# EAGLE design SuperLogger_widewithESPSIM800bevorrouting (EAGLE 8.0.1)
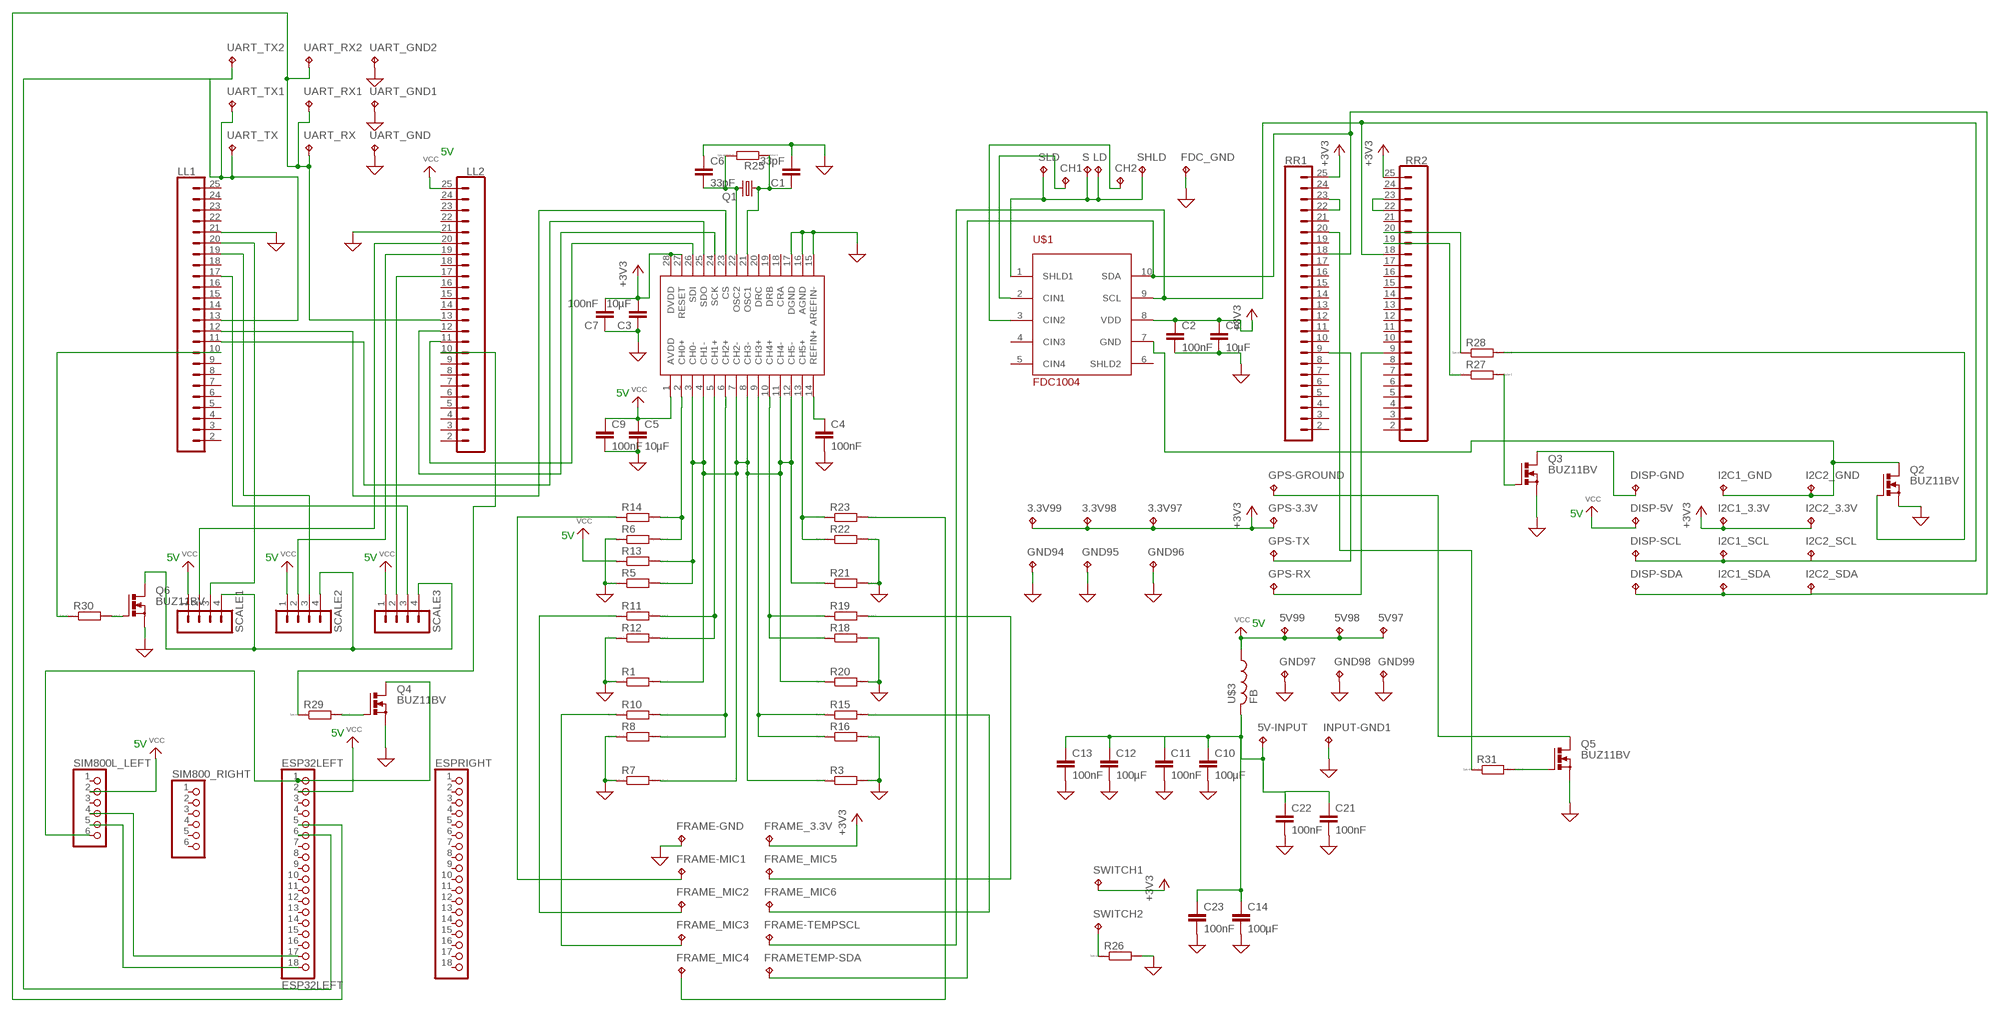
[diagram p0: schematic, sheet 1]

## Parts
3.3V97  ground  TPPAD1-13Y  [P1-13Y]
3.3V98  ground  TPPAD1-13Y  [P1-13Y]
3.3V99  ground  TPPAD1-13Y  [P1-13Y]
5V97  ground  TPPAD1-13Y  [P1-13Y]
5V98  ground  TPPAD1-13Y  [P1-13Y]
5V99  ground  TPPAD1-13Y  [P1-13Y]
5V-INPUT  ground  TPPAD1-13Y  [P1-13Y]
C1  33pF  C5/3  [C5B3]
C2  100nF  C5/3  [C5B3]
C3  10µF  C5/3  [C5B3]
C4  100nF  C5/3  [C5B3]
C5  10µF  C5/3  [C5B3]
C6  33pF  C5/3  [C5B3]
C7  100nF  C5/3  [C5B3]
C8  10µF  C5/3  [C5B3]
C9  100nF  C5/3  [C5B3]
C10  100µF  C5/3  [C5B3]
C11  100nF  C5/3  [C5B3]
C12  100µF  C5/3  [C5B3]
C13  100nF  C5/3  [C5B3]
C14  100µF  C5/3  [C5B3]
C21  100nF  C5/3  [C5B3]
C22  100nF  C5/3  [C5B3]
C23  100nF  C5/3  [C5B3]
CH1  ground  TPPAD1-13Y  [P1-13Y]
CH2  ground  TPPAD1-13Y  [P1-13Y]
DISP-5V  ground  TPPAD1-13Y  [P1-13Y]
DISP-GND  ground  TPPAD1-13Y  [P1-13Y]
DISP-SCL  ground  TPPAD1-13Y  [P1-13Y]
DISP-SDA  ground  TPPAD1-13Y  [P1-13Y]
ESP32LEFT  ESP32LEFT  PINHD-1X18-BIG  [1X18-BIG]
ESPRIGHT  PINHD-1X18-BIG  [1X18-BIG]
FDC_GND  ground  TPPAD1-13Y  [P1-13Y]
FRAME-GND  ground  TPPAD1-13Y  [P1-13Y]
FRAME-MIC1  ground  TPPAD1-13Y  [P1-13Y]
FRAME-TEMPSCL  ground  TPPAD1-13Y  [P1-13Y]
FRAME_3.3V  ground  TPPAD1-13Y  [P1-13Y]
FRAME_MIC2  ground  TPPAD1-13Y  [P1-13Y]
FRAME_MIC3  ground  TPPAD1-13Y  [P1-13Y]
FRAME_MIC4  ground  TPPAD1-13Y  [P1-13Y]
FRAME_MIC5  ground  TPPAD1-13Y  [P1-13Y]
FRAME_MIC6  ground  TPPAD1-13Y  [P1-13Y]
FRAMETEMP-SDA  ground  TPPAD1-13Y  [P1-13Y]
GND94  ground  TPPAD1-13Y  [P1-13Y]
GND95  ground  TPPAD1-13Y  [P1-13Y]
GND96  ground  TPPAD1-13Y  [P1-13Y]
GND97  ground  TPPAD1-13Y  [P1-13Y]
GND98  ground  TPPAD1-13Y  [P1-13Y]
GND99  ground  TPPAD1-13Y  [P1-13Y]
GPS-3.3V  ground  TPPAD1-13Y  [P1-13Y]
GPS-GROUND  ground  TPPAD1-13Y  [P1-13Y]
GPS-RX  ground  TPPAD1-13Y  [P1-13Y]
GPS-TX  ground  TPPAD1-13Y  [P1-13Y]
I2C1_3.3V  ground  TPPAD1-13Y  [P1-13Y]
I2C1_GND  ground  TPPAD1-13Y  [P1-13Y]
I2C1_SCL  ground  TPPAD1-13Y  [P1-13Y]
I2C1_SDA  ground  TPPAD1-13Y  [P1-13Y]
I2C2_3.3V  ground  TPPAD1-13Y  [P1-13Y]
I2C2_GND  ground  TPPAD1-13Y  [P1-13Y]
I2C2_SCL  ground  TPPAD1-13Y  [P1-13Y]
I2C2_SDA  ground  TPPAD1-13Y  [P1-13Y]
INPUT-GND1  ground  TPPAD1-13Y  [P1-13Y]
LD  ground  TPPAD1-13Y  [P1-13Y]
LL1  CONN_24  [1X24]
LL2  CONN_24  [1X24]
Q1  CRYSTALHC49S  [HC49/S]
Q2  BUZ11BV  [TO220BV]
Q3  BUZ11BV  [TO220BV]
Q4  BUZ11BV  [TO220BV]
Q5  BUZ11BV  [TO220BV]
Q6  BUZ11BV  [TO220BV]
R1  R0207/10  [0207/10]
R3  R0207/10  [0207/10]
R5  R0207/10  [0207/10]
R6  R0207/10  [0207/10]
R7  R0207/10  [0207/10]
R8  R0207/10  [0207/10]
R10  R0207/10  [0207/10]
R11  R0207/10  [0207/10]
R12  R0207/10  [0207/10]
R13  R0207/10  [0207/10]
R14  R0207/10  [0207/10]
R15  R0207/10  [0207/10]
R16  R0207/10  [0207/10]
R18  R0207/10  [0207/10]
R19  R0207/10  [0207/10]
R20  R0207/10  [0207/10]
R21  R0207/10  [0207/10]
R22  R0207/10  [0207/10]
R23  R0207/10  [0207/10]
R25  R0207/10  [0207/10]
R26  R0207/10  [0207/10]
R27  R0207/10  [0207/10]
R28  R0207/10  [0207/10]
R29  R0207/10  [0207/10]
R30  R0207/10  [0207/10]
R31  R0207/10  [0207/10]
RR1  CONN_24  [1X24]
RR2  CONN_24  [1X24]
S  ground  TPPAD1-13Y  [P1-13Y]
SCALE1  MA04-1  [MA04-1]
SCALE2  MA04-1  [MA04-1]
SCALE3  MA04-1  [MA04-1]
SHLD  ground  TPPAD1-13Y  [P1-13Y]
SIM800_RIGHT  PINHD-1X6  [1X06]
SIM800L_LEFT  PINHD-1X6  [1X06]
SLD  ground  TPPAD1-13Y  [P1-13Y]
SWITCH1  ground  TPPAD1-13Y  [P1-13Y]
SWITCH2  ground  TPPAD1-13Y  [P1-13Y]
U$1  FDC1004  [MSOP10]
U$2  MCP3903  [MSOP8_0.65MM]
U$3  FB  [FB]
UART_GND  ground  TPPAD1-13Y  [P1-13Y]
UART_GND1  ground  TPPAD1-13Y  [P1-13Y]
UART_GND2  ground  TPPAD1-13Y  [P1-13Y]
UART_RX  ground  TPPAD1-13Y  [P1-13Y]
UART_RX1  ground  TPPAD1-13Y  [P1-13Y]
UART_RX2  ground  TPPAD1-13Y  [P1-13Y]
UART_TX  ground  TPPAD1-13Y  [P1-13Y]
UART_TX1  ground  TPPAD1-13Y  [P1-13Y]
UART_TX2  ground  TPPAD1-13Y  [P1-13Y]

## Nets
+3V3: 3.3V97.TP 3.3V98.TP 3.3V99.TP C2.1 C3.2 C7.2 C8.1 FRAME_3.3V.TP GPS-3.3V.TP I2C1_3.3V.TP I2C2_3.3V.TP RR1.25 RR2.25 SWITCH1.TP U$1.8(VDD) U$2.27(RESET) U$2.28(DVDD)
GND: C1.2 C2.2 C3.1 C4.2 C5.2 C6.1 C7.1 C8.2 C9.2 C10.2 C11.2 C12.2 C13.2 C14.2 C21.2 C22.2 C23.2 FDC_GND.TP FRAME-GND.TP GND94.TP GND95.TP GND96.TP GND97.TP GND98.TP GND99.TP INPUT-GND1.TP LL1.21 LL2.21 Q2.S Q3.S Q4.S Q5.S Q6.S R1.1 R3.2 R5.1 R6.1 R7.1 R8.1 R12.1 R16.2 R18.2 R20.2 R21.2 R22.2 R26.2 U$2.15(AREFIN-) U$2.16(AGND) U$2.17(DGND) UART_GND1.TP UART_GND2.TP UART_GND.TP ; supply symbol labelled SUP
N$1: ESP32LEFT.6 LL1.13 UART_TX1.TP UART_TX2.TP UART_TX.TP
N$2: R15.1 R16.1 U$2.9(CH3+)
N$3: DISP-SDA.TP FRAMETEMP-SDA.TP I2C1_SDA.TP I2C2_SDA.TP RR1.18 U$1.10(SDA)
N$4: R26.1 SWITCH2.TP
N$5: FRAME_MIC3.TP R10.1
N$6: LL2.17 SCALE3.2
N$7: LD.TP S.TP SHLD.TP SLD.TP U$1.1(SHLD1)
N$8: DISP-SCL.TP FRAME-TEMPSCL.TP I2C1_SCL.TP I2C2_SCL.TP RR2.18 U$1.9(SCL)
N$9: CH1.TP U$1.2(CIN1)
N$10: ESP32LEFT.5 LL2.13 UART_RX1.TP UART_RX2.TP UART_RX.TP
N$11: I2C1_GND.TP I2C2_GND.TP Q2.D U$1.7(GND)
N$12: LL2.19 SCALE2.2
N$13: Q2.G R28.2
N$14: LL2.20 SCALE1.2
N$15: LL1.19 SCALE2.3
N$16: LL1.20 SCALE1.3
N$18: R22.1 R23.1 U$2.13(CH5+)
N$19: C6.2 Q1.2 R25.2 U$2.22(OSC2)
N$20: C1.1 Q1.1 R25.1 U$2.21(OSC1)
N$22: LL1.12 U$2.23(CS)
N$23: LL2.12 U$2.24(SCK)
N$25: FRAME-MIC1.TP R14.1
N$26: FRAME_MIC2.TP R11.1
N$27: ESP32LEFT.18 SIM800L_LEFT.5
N$28: R8.2 R10.2 U$2.6(CH2+)
N$29: R11.2 R12.2 U$2.5(CH1+)
N$30: FRAME_MIC6.TP R15.2
N$33: RR2.22 RR2.23
N$34: R1.2 R3.1 R5.2 R7.2 R13.2 R20.1 R21.1 U$2.3(CH0-) U$2.4(CH1-) U$2.7(CH2-) U$2.8(CH3-) U$2.11(CH4-) U$2.12(CH5-)
N$35: R6.2 R14.2 U$2.2(CH0+)
N$36: R18.1 R19.1 U$2.10(CH4+)
N$37: LL1.11 U$2.25(SDO)
N$38: ESP32LEFT.17 SIM800L_LEFT.4
N$39: Q4.G R29.2
N$40: FRAME_MIC4.TP R23.2
N$41: LL2.11 U$2.26(SDI)
N$42: GPS-RX.TP RR2.9
N$43: Q6.D SCALE1.4 SCALE2.4 SCALE3.4
N$44: CH2.TP U$1.3(CIN2)
N$45: GPS-TX.TP RR1.9
N$46: RR1.22 RR1.23
N$47: Q3.G R27.2
N$48: ESP32LEFT.1 Q4.D SIM800L_LEFT.6
N$49: DISP-GND.TP Q3.D
N$50: R31.1 RR1.20
N$51: GPS-GROUND.TP Q5.D
N$52: FRAME_MIC5.TP R19.2
N$53: Q6.G R30.2
N$54: Q5.G R31.2
N$55: R28.1 RR2.20
N$56: C4.1 U$2.14(REFIN+)
N$57: R27.1 RR2.19
N$58: LL1.17 SCALE3.3
N$59: LL1.10 R30.1
N$60: LL2.10 R29.1
VCC: 5V97.TP 5V98.TP 5V99.TP 5V-INPUT.TP C5.1 C9.1 C10.1 C11.1 C12.1 C13.1 C14.1 C21.1 C22.1 C23.1 DISP-5V.TP ESP32LEFT.2 LL2.25 R13.1 SCALE1.1 SCALE2.1 SCALE3.1 SIM800L_LEFT.2 U$2.1(AVDD) U$3.P$1 U$3.P$2
Unconnected: ESP32LEFT.3 ESP32LEFT.4 ESP32LEFT.7 ESP32LEFT.8 ESP32LEFT.9 ESP32LEFT.10 ESP32LEFT.11 ESP32LEFT.12 ESP32LEFT.13 ESP32LEFT.14 ESP32LEFT.15 ESP32LEFT.16 ESPRIGHT.1 ESPRIGHT.2 ESPRIGHT.3 ESPRIGHT.4 ESPRIGHT.5 ESPRIGHT.6 ESPRIGHT.7 ESPRIGHT.8 ESPRIGHT.9 ESPRIGHT.10 ESPRIGHT.11 ESPRIGHT.12 ESPRIGHT.13 ESPRIGHT.14 ESPRIGHT.15 ESPRIGHT.16 ESPRIGHT.17 ESPRIGHT.18 LL1.2 LL1.3 LL1.4 LL1.5 LL1.6 LL1.7 LL1.8 LL1.9 LL1.14 LL1.15 LL1.16 LL1.18 LL1.22 LL1.23 LL1.24 LL1.25 LL2.2 LL2.3 LL2.4 LL2.5 LL2.6 LL2.7 LL2.8 LL2.9 LL2.14 LL2.15 LL2.16 LL2.18 LL2.22 LL2.23 LL2.24 RR1.2 RR1.3 RR1.4 RR1.5 RR1.6 RR1.7 RR1.8 RR1.10 RR1.11 RR1.12 RR1.13 RR1.14 RR1.15 RR1.16 RR1.17 RR1.19 RR1.21 RR1.24 RR2.2 RR2.3 RR2.4 RR2.5 RR2.6 RR2.7 RR2.8 RR2.10 RR2.11 RR2.12 RR2.13 RR2.14 RR2.15 RR2.16 RR2.17 RR2.21 RR2.24 SIM800_RIGHT.1 SIM800_RIGHT.2 SIM800_RIGHT.3 SIM800_RIGHT.4 SIM800_RIGHT.5 SIM800_RIGHT.6 SIM800L_LEFT.1 SIM800L_LEFT.3 U$1.4(CIN3) U$1.5(CIN4) U$1.6(SHLD2) U$2.18(CRA) U$2.19(DRB) U$2.20(DRC)

## Notes on the sheet
- 5V
- 5V
- 5V
- 5V
- 5V | 5V | 5V
- 5V
- 5V
- 5V

## Library data of the parts
3.3V97-3.3V99 5V97-5V99 5V-INPUT CH1 CH2 DISP-5V DISP-GND DISP-SCL DISP-SDA FDC_GND FRAME-GND FRAME-MIC1 FRAME-TEMPSCL FRAME_3.3V FRAME_MIC2-FRAME_MIC6 FRAMETEMP-SDA GND94-GND99 GPS-3.3V GPS-GROUND GPS-RX GPS-TX I2C1_3.3V I2C1_GND I2C1_SCL I2C1_SDA I2C2_3.3V I2C2_GND I2C2_SCL I2C2_SDA INPUT-GND1 LD S SHLD SLD SWITCH1 SWITCH2 UART_GND UART_GND1 UART_GND2 UART_RX UART_RX1 UART_RX2 UART_TX UART_TX1 UART_TX2 = testpad:TP: Test pad
C1-C14 C21-C23 = capacitor-wima:C: CAPACITOR naming: grid - package width
ESP32LEFT ESPRIGHT = adafruit:PINHD-1X18: PIN HEADER
LL1 LL2 RR1 RR2 = SparkFun-Connectors:CONN_24: Multi connection point. Often used as Generic Header-pin footprint for 0.1 inch spaced/style header connections On any of the 0.1 inch spaced packages, you can populate with these: Break Away Headers - Straight <https://www.sparkfun.com/products/116> (PRT-00116) Break Away Male Headers - Right Angle <https://www.sparkfun.com/products/553> (PRT-00553) Female Headers <https://www.sparkfun.com/products/115> (PRT-00115) Break Away Headers - Machine Pin <https://www.sparkfun.com/products/117> (PRT-00117) Break Away Female Headers - Swiss Machine Pin <https://www.sparkfun.com/products/743> (PRT-00743) For SCREWTERMINALS and SPRING TERMINALS visit here: Screw Terimnals on SparkFun.com <https://www.sparkfun.com/search/results?term=Screw+Terminals> (5mm/3.5mm/2.54mm spacing) This device is also useful as a general connection point to wire up your design to another part of your project. Our various solder wires solder well into these plated through hole pads. Hook-Up Wire - Assortment (Stranded, 22 AWG) <https://www.sparkfun.com/products/11375> (PRT-11375) Hook-Up Wire - Assortment (Solid Core, 22 AWG) <https://www.sparkfun.com/products/11367> (PRT-11367) View the entire wire category on our website here <https://www.sparkfun.com/categories/141> Special notes: Molex polarized connector foot print use with SKU : PRT-08231 with associated crimp pins and housings. 1MM SMD Version SKU: PRT-10208 NOTES ON THE VARIANTS LOCK and LOCK_LONGPADS... This footprint was designed to help hold the alignment of a through-hole component (i.e. 6-pin header) while soldering it into place. You may notice that each hole has been shifted either up or down by 0.005 of an inch from it's more standard position (which is a perfectly straight line). This slight alteration caused the pins (the squares in the middle) to touch the edges of the holes. Because they are alternating, it causes a "brace" to hold the component in place. 0.005 has proven to be the perfect amount of "off-center" position when using our standard breakaway headers. Although looks a little odd when you look at the bare footprint, once you have a header in there, the alteration is very hard to notice. Also,if you push a header all the way into place, it is covered up entirely on the bottom side.
Q1 = adafruit:CRYSTAL: CRYSTAL; OC_FARNELL: 1667008; OC_NEWARK: unknown
Q2-Q6 = transistor-power:BUZ11: N-CHANNEL MOS FET
R1 R3 R5-R8 R10-R16 R18-R23 R25-R31 = eagle-ltspice:R: RESISTOR, European symbol; SPICEMODEL: NONE; SPICEPREFIX: R
SCALE1-SCALE3 = con-lstb:MA04-1: PIN HEADER; OC_FARNELL: unknown; OC_NEWARK: unknown
SIM800_RIGHT SIM800L_LEFT = adafruit:PINHD-1X6: PIN HEADER
U$1 = eigene:FDC1004
U$2 = eigene:MCP3903
U$3 = adafruit:FB: Ferrite bead Digikey #P9821BK-ND

## Board
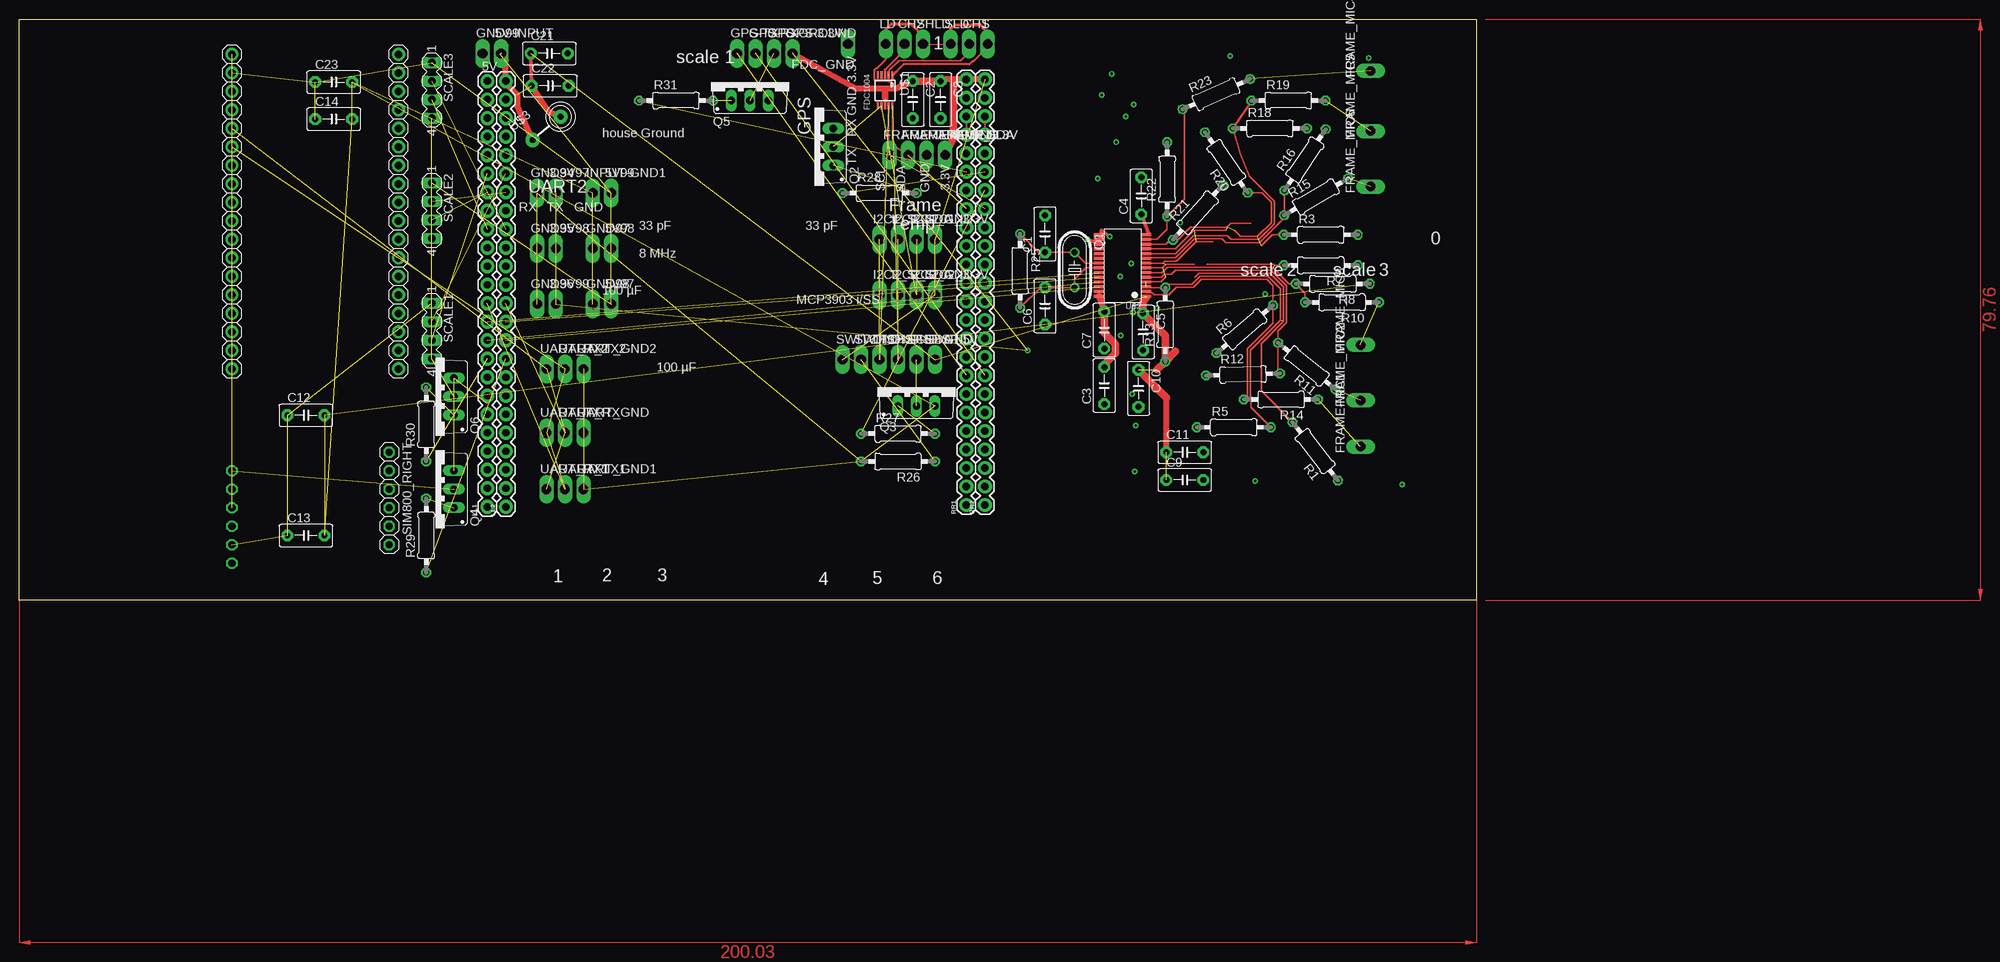
[diagram p1: board, top side]
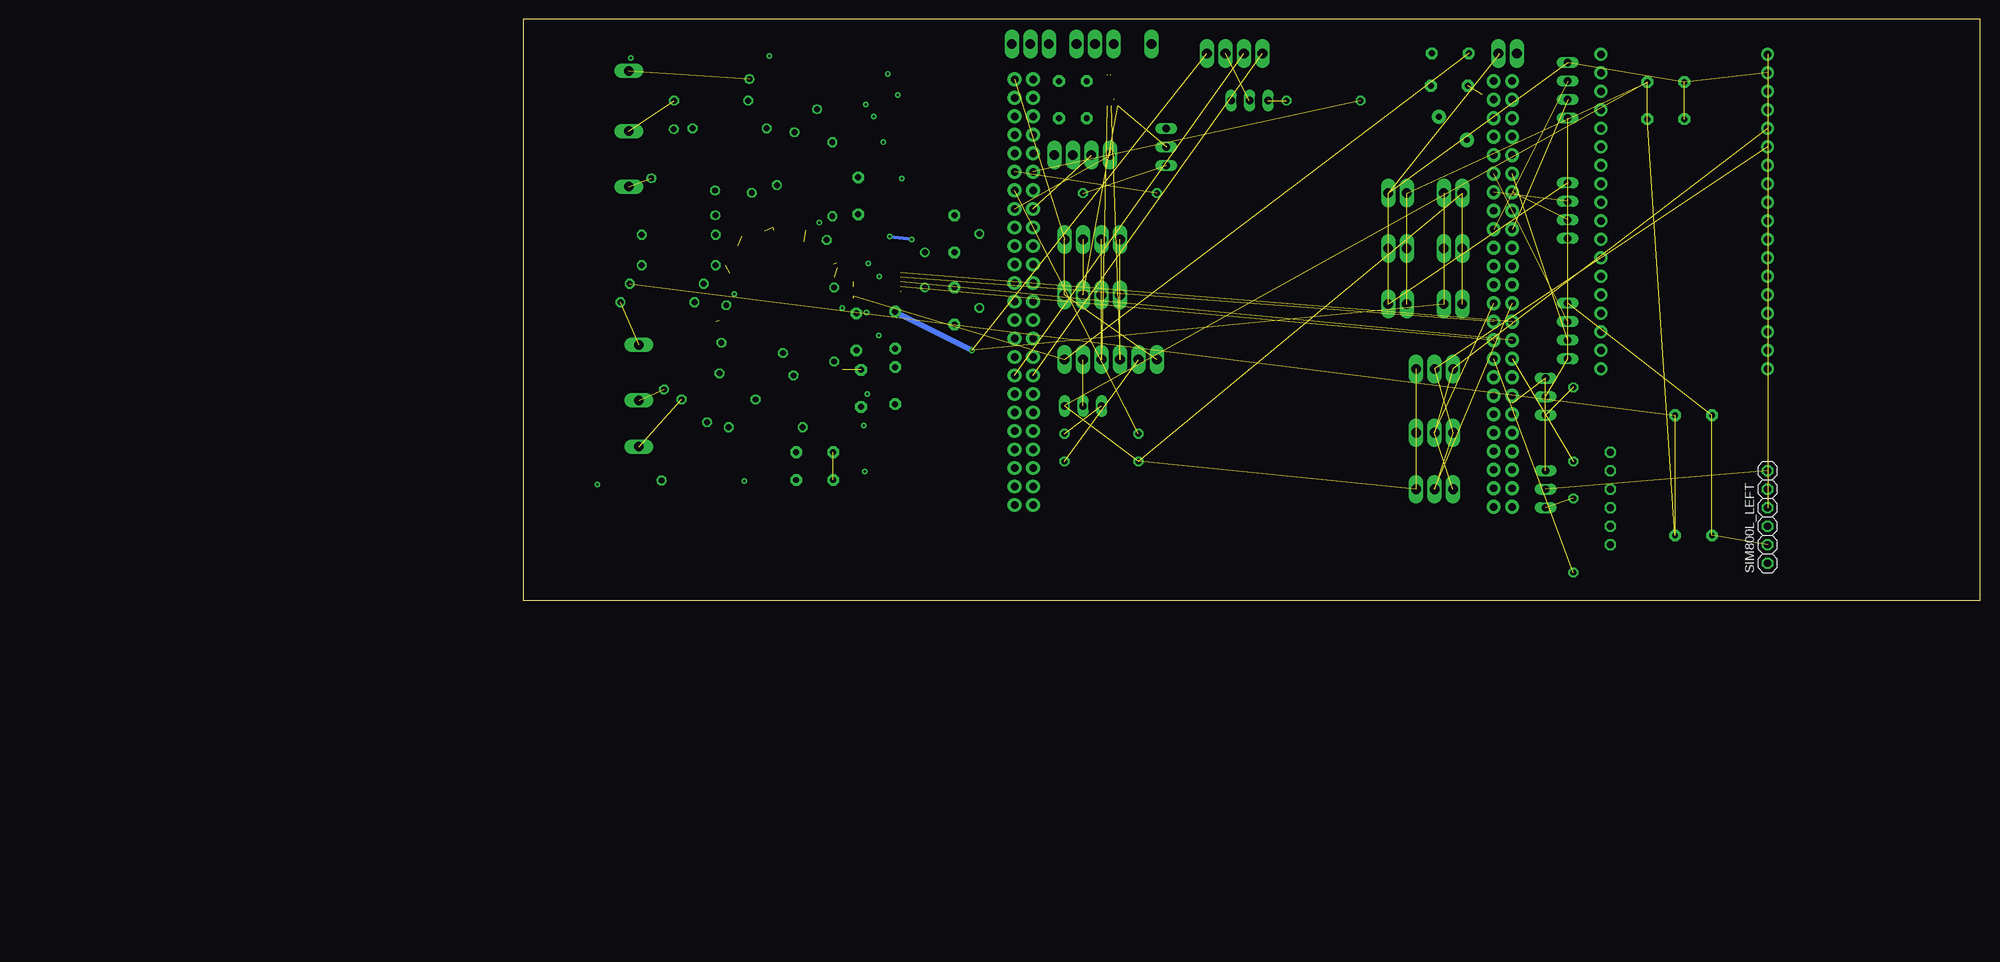
[diagram p2: board, bottom side, seen from below]

Size 200.03 x 79.76 mm. Coordinates in mm from the lower left corner, seen from the top.
Outline: 0,0 0,79.76 200.03,79.76 200.03,0 0,0
Copper layers (1*16): Top 0.035mm / dielectric 1.5mm / Bottom 0.035mm
Design rules "default *": minimum track width 6mil, minimum drill 0.35mm, track to track 8mil, track to pad 8mil, pad to pad 8mil, via to via 8mil, smd to smd 8mil, copper to edge 40mil, drill to drill 6mil, minimum pad ring 10mil, minimum via ring 8mil, stop-mask expansion 4mil, vias tented up to drill 0mil, thermal gap 10mil

### Footprints (pad centres in the part's own frame; a part is rotated, then mirrored left to right if it is on the bottom)
P1-13Y = drill 1.321 pad 1.905 long: TP 0,0
C5B3 = drill 0.813 pad 1.6 octagon: 1 -2.54,0; 2 2.54,0
1X18-BIG = drill 1.016 pad 1.778: 1 -21.59,0; 2 -19.05,0; 3 -16.51,0; 4 -13.97,0; 5 -11.43,0; 6 -8.89,0; 7 -6.35,0; 8 -3.81,0; 9 -1.27,0; 10 1.27,0; 11 3.81,0; 12 6.35,0; 13 8.89,0; 14 11.43,0; 15 13.97,0; 16 16.51,0; 17 19.05,0; 18 21.59,0
1X24 = drill 1.016 pad 1.88: 2 -26.67,0; 3 -24.13,0; 4 -21.59,0; 5 -19.05,0; 6 -16.51,0; 7 -13.97,0; 8 -11.43,0; 9 -8.89,0; 10 -6.35,0; 11 -3.81,0; 12 -1.27,0; 13 1.27,0; 14 3.81,0; 15 6.35,0; 16 8.89,0; 17 11.43,0; 18 13.97,0; 19 16.51,0; 20 19.05,0; 21 21.59,0; 22 24.13,0; 23 26.67,0; 24 29.21,0; 25 31.75,0
HC49/S = drill 0.813: 1 -2.413,0; 2 2.413,0
TO220BV = drill 1.016 long: D 0,-2.54; G -2.54,-2.54; S 2.54,-2.54
0207/10 = drill 0.813 octagon: 1 -5.08,0; 2 5.08,0
MA04-1 = drill 1.016 long: 1 -3.81,0; 2 -1.27,0; 3 1.27,0; 4 3.81,0
1X06 = drill 1.016 octagon: 1 -6.35,0; 2 -3.81,0; 3 -1.27,0; 4 1.27,0; 5 3.81,0; 6 6.35,0
MSOP10 = smd 0.25 x 1: 1 -1,-2.113; 2 -0.5,-2.113; 3 0,-2.113; 4 0.5,-2.113; 5 1,-2.113; 6 1,2.113; 7 0.5,2.113; 8 0,2.113; 9 -0.5,2.113; 10 -1,2.113
MSOP8_0.65MM = smd 0.4 x 1.4: 1 -0.175,-2.3; 2 0.475,-2.3; 3 1.125,-2.3; 4 1.775,-2.3; 5 2.425,-2.3; 6 3.075,-2.3; 7 3.725,-2.3; 8 4.375,-2.3; 9 5.025,-2.3; 10 5.675,-2.3; 11 6.325,-2.3; 12 6.975,-2.3; 13 7.625,-2.3; 14 8.275,-2.3; 15 8.275,4.15; 16 7.625,4.15; 17 6.975,4.15; 18 6.325,4.15; 19 5.675,4.15; 20 5.025,4.15; 21 4.375,4.15; 22 3.725,4.15; 23 3.075,4.15; 24 2.425,4.15; 25 1.775,4.15; 26 1.125,4.15; 27 0.475,4.15; 28 -0.175,4.15
FB = drill 0.8 pad 1.93: P$1 -2.5,0; P$2 2.5,0

### Placement (x,y rotation side)
3.3V97  73.66,55.88 0 top
3.3V98  73.66,48.26 0 top
3.3V99  73.66,40.64 0 top
5V97  81.28,40.64 0 top
5V98  81.28,48.26 0 top
5V99  81.28,55.88 0 top
5V-INPUT  66.17,75.06 0 top
C1  140.84,50.29 90 top
C2  122.68,68.71 270 top
C3  148.97,29.46 90 top
C4  154.05,55.5 90 top
C5  154.31,36.83 270 top
C6  140.84,40.39 90 top
C7  148.97,37.08 90 top
C8  126.49,68.71 270 top
C9  160.02,16.51 0 top
C10  153.67,29.08 270 top
C11  160.02,20.32 0 top
C12  39.37,25.4 0 top
C13  39.37,8.89 0 top
C14  43.18,66.04 0 top
C21  72.77,75.06 0 top
C22  72.9,70.61 0 top
C23  43.18,71.12 0 top
CH1  130.43,76.33 0 top
CH2  121.54,76.33 0 top
DISP-5V  125.73,33.02 0 top
DISP-GND  123.19,33.02 0 top
DISP-SCL  118.11,33.02 0 top
DISP-SDA  120.65,33.02 0 top
ESP32LEFT  29.21,53.34 270 top
ESPRIGHT  52.07,53.34 270 top
FDC_GND  113.79,76.33 180 top
FRAME-GND  124.59,61.09 0 top
FRAME-MIC1  184.15,21.08 90 top
FRAME-TEMPSCL  119.51,61.09 0 top
FRAME_3.3V  127.13,61.09 0 top
FRAME_MIC2  184.15,27.43 90 top
FRAME_MIC3  184.15,35.05 90 top
FRAME_MIC4  185.55,72.64 90 top
FRAME_MIC5  185.55,64.39 90 top
FRAME_MIC6  185.55,56.77 90 top
FRAMETEMP-SDA  122.05,61.09 0 top
GND94  71.12,55.88 0 top
GND95  71.12,48.26 0 top
GND96  71.12,40.64 0 top
GND97  78.74,48.26 0 top
GND98  78.74,40.64 0 top
GND99  63.63,75.06 0 top
GPS-3.3V  106.17,75.06 0 top
GPS-GROUND  103.63,75.06 0 top
GPS-RX  101.09,75.06 0 top
GPS-TX  98.55,75.06 0 top
I2C1_3.3V  125.73,49.53 0 top
I2C1_GND  123.19,49.53 0 top
I2C1_SCL  118.11,49.53 0 top
I2C1_SDA  120.65,49.53 0 top
I2C2_3.3V  125.73,41.91 0 top
I2C2_GND  123.19,41.91 0 top
I2C2_SCL  118.11,41.91 0 top
I2C2_SDA  120.65,41.91 0 top
INPUT-GND1  78.74,55.88 0 top
LD  119,76.33 0 top
LL1  64.26,39.5 90 top
LL2  66.8,39.5 90 top
Q1  144.91,45.34 270 top
Q2  109.22,62.23 90 top
Q3  123.19,29.21 0 top
Q4  57.15,15.24 90 top
Q5  100.33,71.12 0 top
Q6  57.15,27.94 90 top
R1  177.93,20.45 127.9 top
R3  178.69,50.16 0 top
R5  166.75,23.75 0 top
R6  168.28,37.21 40.2 top
R7  178.69,45.97 180 top
R8  180.34,43.43 180 top
R10  181.61,40.89 180 top
R11  176.78,32.13 140.9 top
R12  168.02,30.99 1.6 top
R13  157.35,37.85 90 top
R14  173.23,27.56 180 top
R15  178.05,55.37 30 top
R16  176.53,60.45 56 top
R18  171.7,64.77 0 top
R19  174.24,68.58 0 top
R20  165.74,60.07 125.2 top
R21  161.8,53.21 47.7 top
R22  157.61,57.78 90 top
R23  164.34,69.47 24.1 top
R25  137.41,45.21 270 top
R26  120.65,19.05 180 top
R27  120.65,22.86 0 top
R28  118.11,55.88 0 top
R29  55.88,8.89 90 top
R30  55.88,24.13 90 top
R31  90.17,68.58 0 top
RR1  130.05,39.75 90 top
RR2  132.59,39.75 90 top
S  132.97,76.33 0 top
SCALE1  56.64,36.96 270 top
SCALE2  56.64,53.47 270 top
SCALE3  56.64,69.98 270 top
SHLD  124.08,76.33 0 top
SIM800_RIGHT  50.8,13.97 270 top
SIM800L_LEFT  29.21,11.43 90 bottom
SLD  127.89,76.33 0 top
SWITCH1  113.03,33.02 0 top
SWITCH2  115.57,33.02 0 top
U$1  118.87,69.98 180 top
U$2  152.4,41.91 90 top
U$3  72.39,64.77 39.8 top
UART_GND  77.47,22.99 0 top
UART_GND1  77.47,15.24 0 top
UART_GND2  77.47,31.75 0 top
UART_RX  74.93,22.99 0 top
UART_RX1  72.39,15.24 0 top
UART_RX2  72.39,31.75 0 top
UART_TX  72.39,22.99 0 top
UART_TX1  74.93,15.24 0 top
UART_TX2  74.93,31.75 0 top

### Tracks (layer width: path | path; a pad name or v marks a point on that pad's centre or on a via)
+3V3  (via drill 0.35)  (9 unrouted)
  Top 0.152: 128.25,71.36 C8.1
  Top 0.203: U$1.8 118.94,68.7 118.94,69.25 119.21,68.75
  Top 0.508: 148.25,42.33 U$2.28
  Top 0.813: U$2.28 C7.2 | GPS-3.3V.TP 114.8,70.24 118.75,70.24 118.87,68.85 118.99,70.24 120.41,70.24 C2.1 | RR2.25 RR1.25 126.49,71.5 C8.1
  Top 1.016: C8.1 C2.1 | C3.2 148.97,32.41 150.48,33.92 150.48,35.17 148.97,36.68 C7.2 | FRAME_3.3V.TP 128.25,63.48 128.25,71.36
  Bottom 0.813: C7.2 v138.43,34.29
GND  (via drill 0.35)  (16 unrouted)
  Top 0.508: v149.73,49.91 148.59,50.8 U$2.17 v146.69,49.53
  Bottom 0.508: v146.69,49.53 v149.73,49.91
  other vias: 189.87,15.88 151.89,66.42 152.65,46.23 156.21,40.13 153.16,17.65 153.29,24 148.08,57.91 185.29,74.42 166.24,74.68 153.03,68.07 159.38,51.82 151.26,36.32 152.91,39.5 152.78,28.32 148.59,69.34 169.67,16.38 171.07,42.04 151.13,44.45 149.99,72.26 150.62,62.87
N$1  (4 unrouted)
N$2
  Top 0.203: U$2.9 154.75,46.99 158.75,46.99 161.37,49.61 165.1,49.61 165.66,49.05 170.27,49.05 173.44,52.22 173.44,52.62 R15.1 173.69,52.87 R16.1
N$3  (4 unrouted)
  Top 0.203: U$1.10 119.87,62.5 FRAMETEMP-SDA.TP
N$4  (1 unrouted)
N$5  (1 unrouted)
N$6  (1 unrouted)
N$7  (1 unrouted)
  Top 0.152: SHLD.TP SLD.TP
  Top 0.203: 117.37,71.43 117.59,71.21 119.38,71.21 119.46,71.28 119.62,71.28 119.87,71.54 U$1.1
  Top 0.254: LD.TP 119,74.24 117.73,72.97 117.59,72.97 117.37,72.75 117.37,71.43 | 119.87,71.57 U$1.1 | 120.41,72.63 U$1.1 | 119.38,71.21 119.66,71.21 119.88,71.43 | 119.88,71.43 U$1.1 | S.TP 132.97,76.2 132.97,75.94 131,73.97 130.85,73.97 130.45,73.56 121.44,73.56 119.88,72 119.88,71.88 119.88,71.43
  Top 0.406: LD.TP 119,78.36 119.76,79.12 122.43,79.12 124.21,77.34 124.21,76.45 SHLD.TP | SLD.TP 127.89,78.36 128.52,78.99 131.95,78.99 132.33,78.61 132.33,78.49 133.35,77.47 133.35,76.58 132.97,76.2
N$8  (5 unrouted)
  Top 0.203: U$1.9 119.37,62.23
N$9  (1 unrouted)
  Top 0.203: CH1.TP 130.43,75.23 129.24,74.04 120.77,74.04 119.44,72.71 119.44,72.16
N$10  (4 unrouted)
N$11  (3 unrouted)
N$12  (1 unrouted)
N$13  (1 unrouted)
N$14  (1 unrouted)
N$15  (1 unrouted)
N$16  (1 unrouted)
N$18
  Top 0.203: R23.1 159.95,67.22 159.95,55.05 R22.1 157.61,50.93 156.21,49.53 U$2.13
N$19
  Top 0.203: U$2.22 146.47,45.63 144.91,44.07 Q1.2 C6.2 140.21,42.93 R25.2
N$20
  Top 0.203: U$2.21 146.37,46.28 Q1.1 C1.1 139.95,47.75 R25.1
N$22  (1 unrouted)
N$23  (1 unrouted)
N$25  (1 unrouted)
N$26  (1 unrouted)
N$27  (1 unrouted)
N$28
  Top 0.152: 154.87,45.16 U$2.6
  Top 0.203: R10.2 176.53,42.16 R8.2 174.31,43.43 172.03,45.72 157.63,45.72 156.9,44.98 U$2.6
N$29
  Top 0.203: U$2.5 156.82,44.34 157.22,44.73 158.17,44.73 158.75,45.31 171.86,45.31 173.99,43.18 173.99,38.1 172.84,36.95 R11.2 172.84,31.39 R12.2
N$30  (1 unrouted)
N$33
  Top 0.203: RR2.23 RR2.22
N$34  (9 unrouted)
  Top 0.152: 154.93,43.02 U$2.3
  Top 0.203: 154.93,43.02 155.03,42.93 R13.2 157.78,43.36 161.03,43.36 162.12,44.45 171.45,44.45 173.18,42.72 173.18,38.44 169.06,34.32 169.06,28.01 169.11,27.96 169.11,26.47 R5.2 | 161.42,44.32 162,44.91 171.69,44.91 173.58,43.01 173.58,38.27 170.53,35.21 170.53,28.73 R1.2 | U$2.4 156.75,43.69 157.38,44.32 | U$2.8 157.05,46.28 157.3,46.53 158.75,46.53 158.8,46.58 158.92,46.58 161.53,49.2 163.91,49.2 | R3.1 172.09,50.16 170.56,48.64 | U$2.7 156.97,45.63 157.46,46.13 161.31,46.13 | R7.2 172.34,45.97 172.19,46.13 163.04,46.13 | 169.11,51.77 166.37,51.77 165.82,51.21 160.88,51.21 160.84,51.25 158.98,49.4 R21.1 158.04,49.46 157.47,48.88 U$2.12 | 165.68,50.8 165.67,50.81 161.3,50.81 158.72,48.23 U$2.11 | 166.88,50.7 167.64,49.94 170.01,49.94 171.91,51.83 171.91,54.63 170.61,55.92 R20.1
N$35
  Top 0.203: U$2.2 154.84,42.24 155.53,42.24 155.86,41.91 157.86,41.91 158.9,42.95 161.19,42.95 162.29,44.04 171.28,44.04 172.16,43.17 R6.2 | 172.16,39.12 R6.2 | R6.2 172.16,41.34 | R6.2 172.16,37.99 168.66,34.49 168.66,28.07 R14.2
N$36
  Top 0.203: R18.1 167.64,61.21 168.91,58.2 172.31,54.79 172.31,51.66 170.18,49.53 166.37,49.53 165.89,50.01 161.2,50.01 158.77,47.59 U$2.10
  Top 0.254: R19.1 R18.1
N$37  (1 unrouted)
N$38  (1 unrouted)
N$39  (1 unrouted)
N$40  (1 unrouted)
N$41  (1 unrouted)
N$42  (1 unrouted)
N$43  (3 unrouted)
N$44
  Top 0.203: U$1.3 118.87,72.83 119.54,73.5
  Top 0.254: CH2.TP 121.54,75.5 119.54,73.5 118.86,72.82 118.86,72.76
N$45  (1 unrouted)
N$46
  Top 0.203: RR1.23 RR1.22
N$47  (1 unrouted)
N$48  (2 unrouted)
N$49  (1 unrouted)
N$50  (1 unrouted)
N$51  (1 unrouted)
N$52  (1 unrouted)
N$53  (1 unrouted)
N$54  (1 unrouted)
N$55  (1 unrouted)
N$56
  Top 0.406: U$2.14 155.09,50.19 C4.1
  Top 0.508: C4.1 155.09,50.19 154.7,50.19
N$57  (1 unrouted)
N$58  (1 unrouted)
N$59  (1 unrouted)
N$60  (1 unrouted)
VCC  (19 unrouted)
  Top 0.508: 66.04,74.93 66.98,76.2 | C21.1 C22.1
  Top 0.813: 66.04,74.93 66.8,74.17 LL2.25 66.8,70.9 68.35,69.35 68.35,67.86 U$3.P$1 | C11.1 157.48,27.81 | U$3.P$2 72.72,66.98 C22.1
  Top 1.016: 156.21,31.62 R13.1 | R13.1 157.35,36.32 C5.1 154.31,41.03 154.7,41.43 | R13.1 158.75,34.16 | 157.48,27.81 C10.1
(copper drawn outside any net)
  shapes: Top area x2

### Text on the board
tPlace: 1 | scale 1 | 5V | 3.3V | GND | FDC1004 | house Ground | GPS | RX | TX | UART2 | SCL | SDA | GND | 3.3V | RX | TX | GND | Frame | 33 pF | 33 pF | Temp | 0 | 8 MHz | scale | 2 | scale | 3 | 100 µF | MCP3903 i/SS | 100 µF | 2 | 3 | 1 | 4 | 5 | 6